# Altium project Buck_Converter.PrjPcb
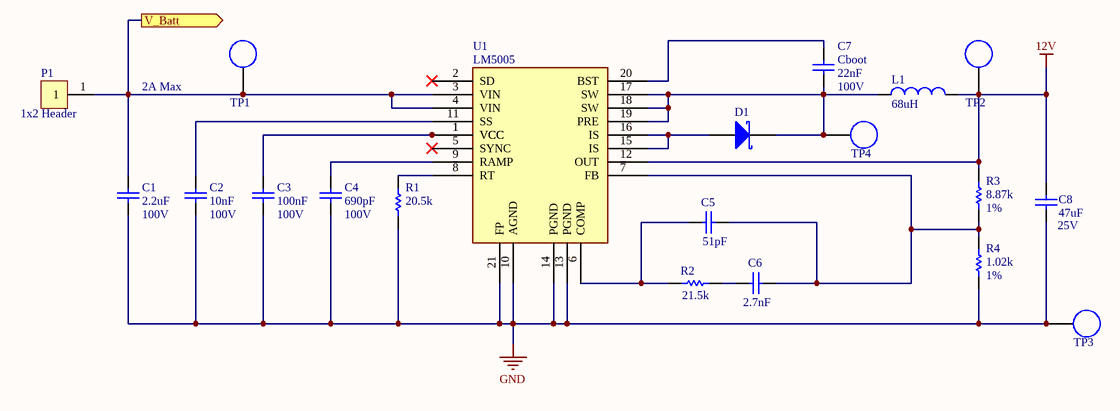
[diagram p0: Buck_Schematic.schdoc]
1 sheet, 20 parts. Net scope: flat (ports and power ports of the same name join across sheets).
Board file: Buck_PCB.PcbDoc

## Sheet Buck_Schematic.schdoc: 44V -> 12V Buck
size A4; Author: Gaston Lee; Organization: Waterloop; Address1: 200 University Ave W; Address2: Engineering 5, 1104; Address3: Waterloo, ON; Address4: N2L 3G1; Revision: A; SheetNumber: 1; SheetTotal: 1

### Parts
C1  value 2.2uF  [1210 - Capacitor]
C2  value 10nF  [0805 - Capacitor]
C3  value 100nF  [0805 - Capacitor]
C4  value 690pF  [0805 - Capacitor]
C5  value 51pF  [0805 - Capacitor]
C6  value 2.7nF  [0805 - Capacitor]
C7  Cboot  value 22nF  [0805 - Capacitor]
C8  value 47uF  [1206 - Capacitor]  (hidden comment: Capacitor - Nonpolarized)
D1  Diode - Schottky  [SMA - DIODE]  (value not drawn)
L1  value 68uH  [MSS1210 - INDUCTOR]  (hidden comment: Inductor)
P1  1x2 Header  [74650094R]
R1  value 20.5k  [0603 - Resistor]
R2  value 21.5k  [0603 - Resistor]
R3  value 8.87k  [0805 - Resistor]
R4  value 1.02k  [0805 - Resistor]
TP1  Test Point  [Test Point]  (value not drawn)  (no BOM)
TP2  Test Point  [Test Point]  (value not drawn)  (no BOM)
TP3  Test Point  [Test Point]  (value not drawn)  (no BOM)
TP4  Test Point  [Test Point]  (value not drawn)  (no BOM)
U1  LM5005  [LM5005]

### Ports
V_Batt (out)

### Nets
12V: C8.2 L1.2 R3.2 TP2.TP? U1.12(OUT)
GND: C1.1 C2.1 C3.1 C4.1 C8.1 R1.1 R4.1 TP3.TP? U1.10(AGND) U1.13(PGND) U1.14(PGND) U1.21(FP)
NetC1_2: C1.2 P1.1 TP1.TP? U1.3(VIN) U1.4(VIN) ; port V_Batt
NetC2_2: C2.2 U1.11(SS)
NetC3_2: C3.2 U1.1(VCC)
NetC4_2: C4.2 U1.9(RAMP)
NetC5_1: C5.1 C6.1 R3.1 R4.2 U1.7(FB)
NetC5_2: C5.2 R2.2 U1.6(COMP)
NetC6_2: C6.2 R2.1
NetC7_1: C7.1 D1.2(K) L1.1 TP4.TP? U1.17(SW) U1.18(SW) U1.19(PRE)
NetC7_2: C7.2 U1.20(BST)
NetD1_1: D1.1(A) U1.15(IS) U1.16(IS)
NetR1_2: R1.2 U1.8(RT)

Not connected (* = marked no-connect by the designer): U1 2(SD)* 5(SYNC)*

### Notes on the sheet
- 2A Max
- (near C7) 100V
- (near C1) 100V
- (near C2) 100V
- (near C3) 100V
- (near C4) 100V
- (near R3) 1%
- (near C8) 25V
- (near R4) 1%
- Title:
- Size:
- Date:
- A4
- Author:
- Revision:
- Sheet
- of
- File:

### Library data of the parts
C1-C8 = Capacitor - Nonpolarized: Nonpolarized Capacitor; Supplier Part Number: *; Supplier: *; Manufacturer: *; Rating: *; Manufacturer Part Number: *
  C1-C7: Supplier 1: Digi-Key
D1 = Diode - Schottky: Schottky Rectifier; Rating: *; Supplier Part Number: *; Supplier: *; Manufacturer: *; ComponentLink1Description: Manufacturer Link; ComponentLink1URL: http://www.irf.com/; ComponentLink2Description: Datasheet; ComponentLink2URL: http://www.irf.com/product-info/datasheets/data/10tq.pdf; Value: *; Supplier 1: Digi-Key
P1 = 74650094R
R1-R4 = Resistor: Rating: *; Manufacturer Part Number: *; Manufacturer: *; Supplier Part Number: *; Supplier: *; Supplier 1: Digi-Key
U1 = LM5005: 7V to 75V 2.5A, Buck Converter; Manufacturer: Texas Instruments; Manufacturer Part Number: LM5005MHX/NOPB; Datasheet: https://www.ti.com/lit/ds/symlink/lm5005.pdf?HQS=TI-null-null-digikeymode-df-pf-null-wwe&ts=1606456124909; Supplier Part Number: 926-LM5005MHX/NOPB; Supplier: Mouser; Supplier 1: Digi-Key
L1 = Inductor: Rating: *; Manufacturer Part Number: *; Supplier Part Number: *; Supplier: *; Manufacturer: *; Supplier 1: Mouser